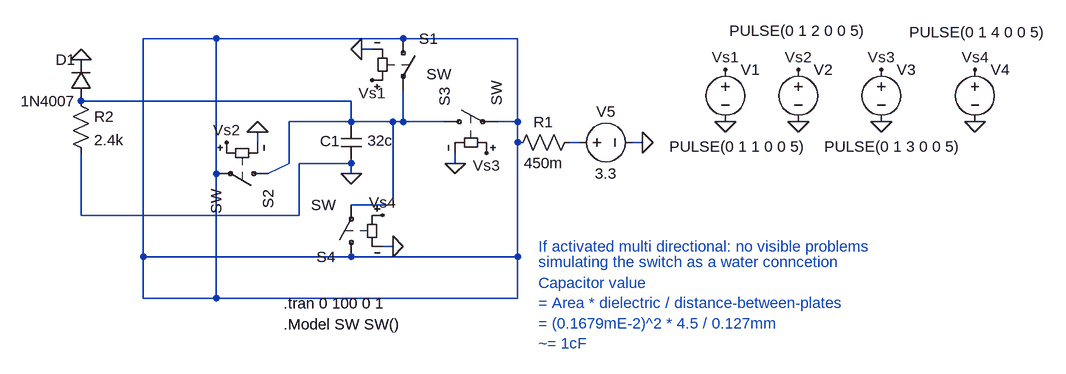
[diagram p0: schematic multi_directional_cap_test.asc]
multi_directional_cap_test.asc, the LTspice schematic file:
Version 4
SHEET 1 880 680
WIRE -544 -48 -656 -48
WIRE -256 -48 -544 -48
WIRE -80 -48 -256 -48
WIRE -304 -32 -320 -32
WIRE -336 48 -752 48
WIRE -336 80 -336 48
WIRE -336 80 -432 80
WIRE -272 80 -336 80
WIRE -256 80 -256 32
WIRE -256 80 -272 80
WIRE -192 80 -256 80
WIRE -80 80 -80 -48
WIRE -80 80 -112 80
WIRE -480 112 -480 96
WIRE -80 112 -80 80
WIRE 16 112 0 112
WIRE 112 112 96 112
WIRE -432 144 -432 80
WIRE -336 144 -416 144
WIRE -176 144 -176 128
WIRE -544 160 -544 -48
WIRE -464 160 -432 144
WIRE -336 160 -336 144
WIRE -272 208 -272 80
WIRE -272 208 -336 208
WIRE -752 224 -752 128
WIRE -416 224 -416 144
WIRE -416 224 -752 224
WIRE -272 272 -288 272
WIRE -656 288 -656 -48
WIRE -336 288 -656 288
WIRE -80 288 -80 112
WIRE -80 288 -336 288
WIRE -656 352 -656 288
WIRE -544 352 -544 160
WIRE -544 352 -656 352
WIRE -80 352 -80 288
WIRE -80 352 -544 352
FLAG 112 112 0
FLAG -320 -32 0
FLAG -480 96 0
FLAG -176 144 0
FLAG -272 272 0
FLAG 240 0 Vs1
FLAG 352 0 Vs2
FLAG 480 0 Vs3
FLAG 624 0 Vs4
FLAG -304 16 Vs1
FLAG -528 112 Vs2
FLAG -288 224 Vs4
FLAG -128 128 Vs3
FLAG 240 80 0
FLAG 352 80 0
FLAG 480 80 0
FLAG 624 80 0
FLAG -752 -16 0
FLAG -336 160 0
SYMBOL voltage 240 -16 R0
WINDOW 3 -86 134 Left 2
WINDOW 123 0 0 Left 0
WINDOW 39 0 0 Left 0
SYMATTR Value PULSE(0 1 1 0 0 5)
SYMATTR InstName V1
SYMBOL voltage 352 -16 R0
WINDOW 3 -106 -44 Left 2
WINDOW 123 0 0 Left 0
WINDOW 39 0 0 Left 0
SYMATTR Value PULSE(0 1 2 0 0 5)
SYMATTR InstName V2
SYMBOL voltage 480 -16 R0
WINDOW 3 -88 134 Left 2
WINDOW 123 0 0 Left 0
WINDOW 39 0 0 Left 0
SYMATTR Value PULSE(0 1 3 0 0 5)
SYMATTR InstName V3
SYMBOL voltage 624 -16 R0
WINDOW 3 -101 -42 Left 2
WINDOW 123 0 0 Left 0
WINDOW 39 0 0 Left 0
SYMATTR Value PULSE(0 1 4 0 0 5)
SYMATTR InstName V4
SYMBOL voltage 0 112 R270
WINDOW 0 32 56 VTop 2
WINDOW 3 -32 56 VBottom 2
WINDOW 123 0 0 Left 0
WINDOW 39 0 0 Left 0
SYMATTR InstName V5
SYMATTR Value 3.3
SYMBOL cap -352 80 R0
WINDOW 0 -32 30 Left 2
WINDOW 3 41 29 Left 2
SYMATTR InstName C1
SYMATTR Value 32c
SYMBOL sw -256 -64 R0
WINDOW 3 36 71 Left 2
SYMATTR InstName S1
SYMBOL sw -448 160 R90
SYMATTR InstName S2
SYMBOL sw -208 80 R270
SYMATTR InstName S3
SYMBOL sw -336 304 R180
SYMATTR InstName S4
SYMBOL res -768 32 R0
SYMATTR InstName R2
SYMATTR Value 2.4k
SYMBOL diode -736 48 R180
WINDOW 0 24 64 Left 2
WINDOW 3 24 0 Left 2
SYMATTR InstName D1
SYMATTR Value 1N4007
SYMBOL res 16 96 R90
WINDOW 0 0 56 VBottom 2
WINDOW 3 32 56 VTop 2
SYMATTR InstName R1
SYMATTR Value 450m
TEXT -440 360 Left 2 !.tran 0 100 0 1
TEXT -440 392 Left 2 !.Model SW SW()
TEXT -48 272 Left 2 ;If activated multi directional: no visible problems
TEXT -48 296 Left 2 ;simulating the switch as a water conncetion
TEXT -48 328 Left 2 ;Capacitor value \n= Area * dielectric / distance-between-plates \n= (0.1679mE-2)^2 * 4.5 / 0.127mm \n~= 1cF

The netlist it stands for:
* multi_directional_cap_test.asc
V1 Vs1 0 PULSE(0 1 1 0 0 5)
V2 Vs2 0 PULSE(0 1 2 0 0 5)
V3 Vs3 0 PULSE(0 1 3 0 0 5)
V4 Vs4 0 PULSE(0 1 4 0 0 5)
V5 N003 0 3.3
C1 N002 0 32c
S1 N001 N002 Vs1 0 SW
S2 N002 N001 Vs2 0 SW
S3 N002 N001 Vs3 0 SW
S4 N001 N002 Vs4 0 SW
R2 N002 0 2.4k
D1 N002 0 1N4007
R1 N003 N001 450m
.model D D
.lib standard.dio
.tran 0 100 0 1
.Model SW SW()
* If activated multi directional: no visible problems
* simulating the switch as a water conncetion
* Capacitor value
* = Area * dielectric / distance-between-plates
* = (0.1679mE-2)^2 * 4.5 / 0.127mm
* ~= 1cF
.backanno
.end

* Results of the author's LTspice run, read from the files saved beside the schematic
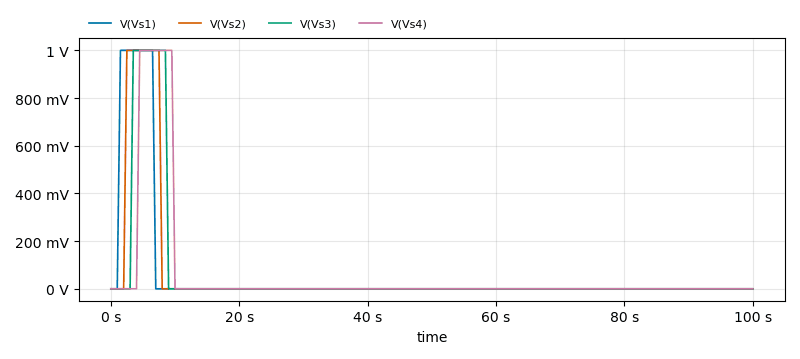
[diagram p1: Transient Analysis of multi_directional_cap_test.asc, plotted from the saved traces]
* Transient Analysis, 1 run:
*   V(Vs1): min 0 V, max 1 V, average 55 mV, rms 231.4 mV, last 0 V
*   V(Vs2): min 0 V, max 1 V, average 55 mV, rms 232.2 mV, last 0 V
*   V(Vs3): min 0 V, max 1 V, average 55 mV, rms 231.4 mV, last 0 V
*   V(Vs4): min 0 V, max 1 V, average 55 mV, rms 231.6 mV, last 0 V